# EAGLE schematic brick_i2c_gyro_l3gd20 (EAGLE 7.3.0)
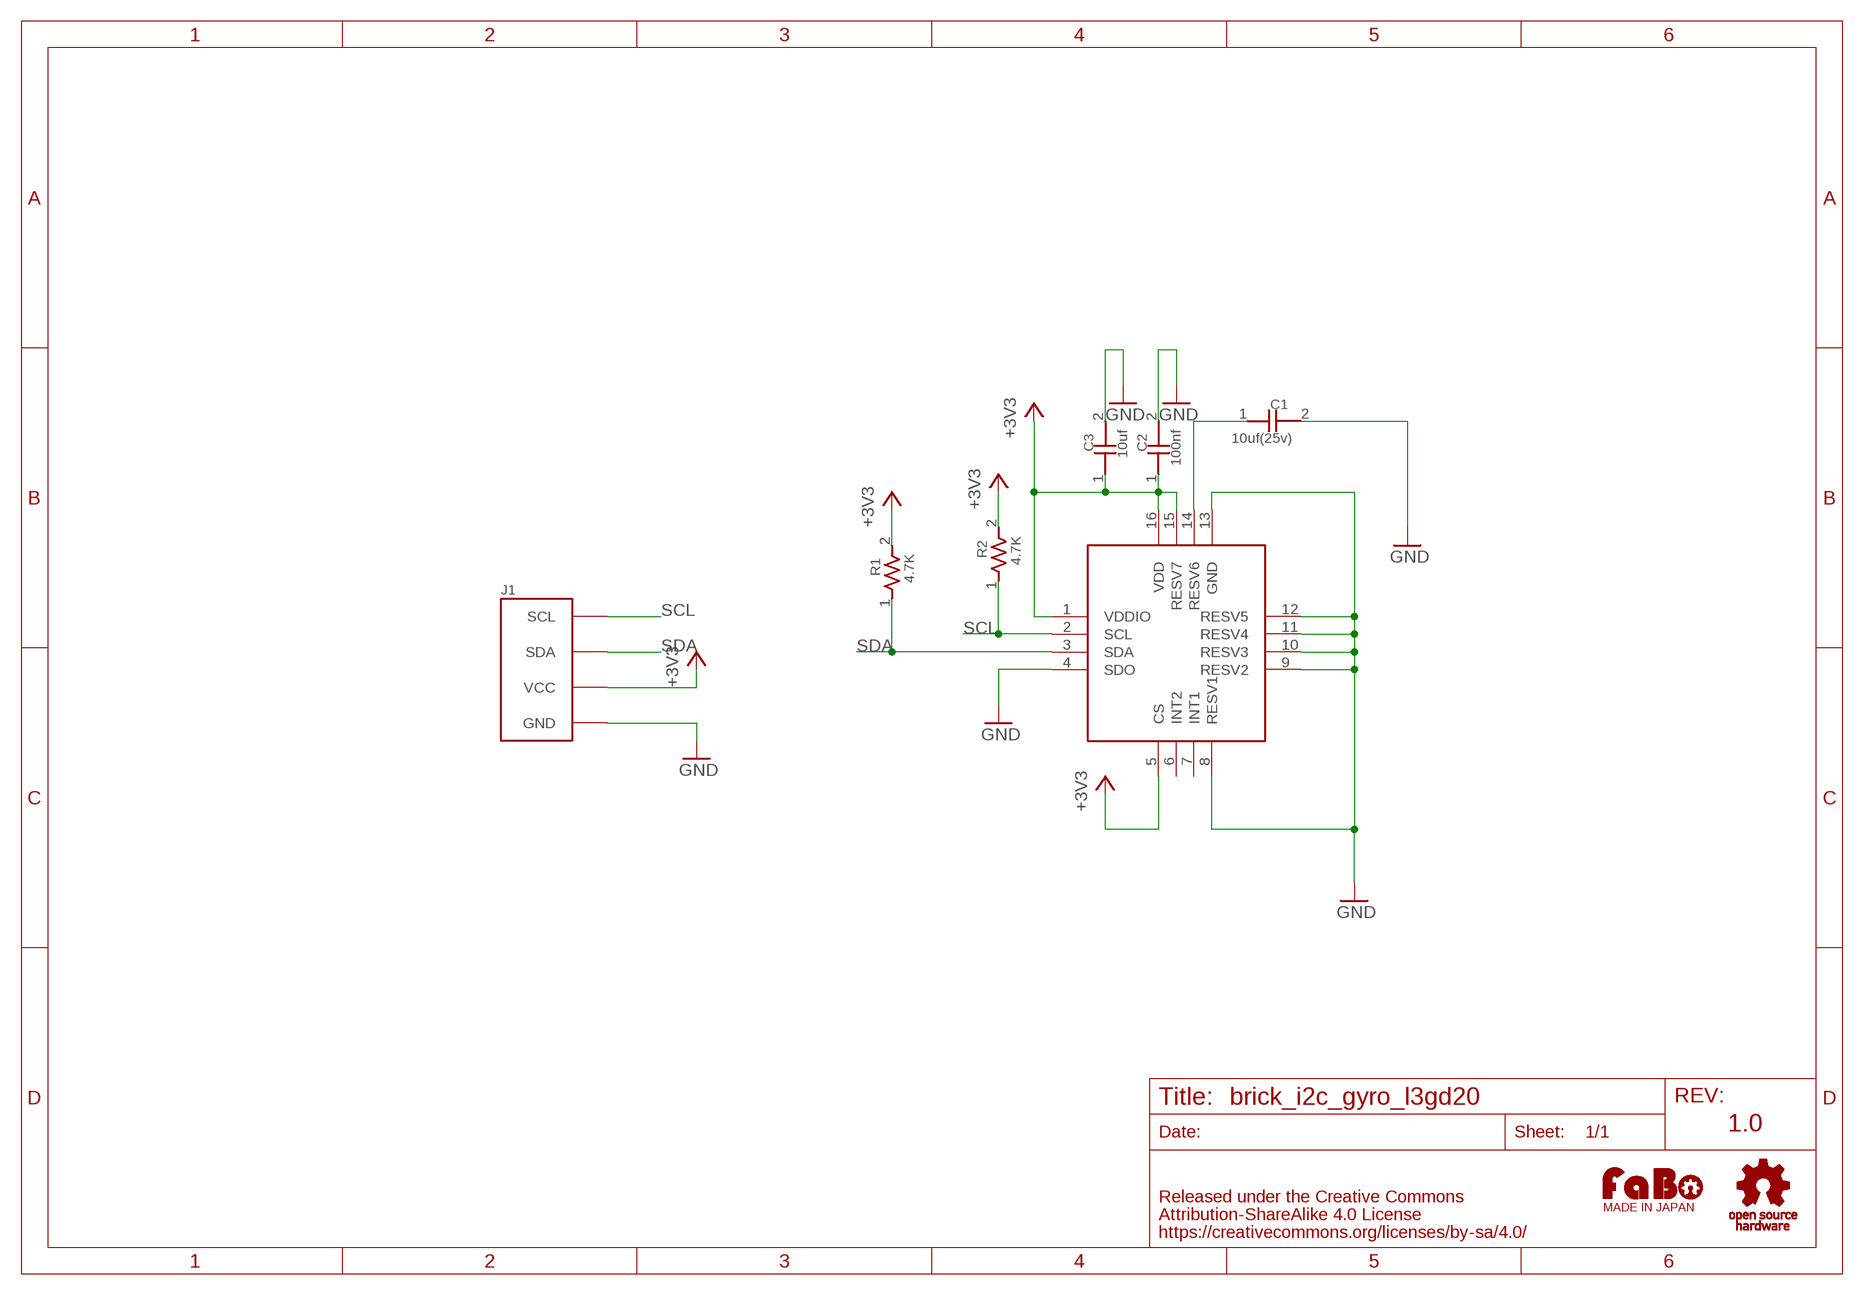
[diagram p0: schematic, sheet 1]

## Parts
C1  10uf(25v)  CAPACITOR0603  [0603]
C2  100nf  CAPACITOR0603  [0603]
C3  10uf  CAPACITOR0603  [0603]
J1  BRICK_I2C  [BRICK_I2C]
R1  4.7K  RESISTOR0603  [0603]
R2  4.7K  RESISTOR0603  [0603]
U$1  LOGO_OSHW_T-M  [LOGO_OSHW_T_M]
U$3  ST-L3GD20  [LGA-16]
U$4  LOGO_FABO-M  [LOGO_FABO_M]

## Nets
+3V3: C2.1 C3.1 J1.VCC R1.2 R2.2 U$3.1(VDDIO) U$3.5(CS) U$3.15(RESV7) U$3.16(VDD)
GND: C1.2 C2.2 C3.2 J1.GND U$3.4(SDO) U$3.8(RESV1) U$3.9(RESV2) U$3.10(RESV3) U$3.11(RESV4) U$3.12(RESV5) U$3.13(GND)
N$3: C1.1 U$3.14(RESV6)
SCL: J1.SCL R2.1 U$3.2(SCL)
SDA: J1.SDA R1.1 U$3.3(SDA)
Unconnected: U$3.6(INT2) U$3.7(INT1)

## Notes on the sheet
- 1.0

## Library data of the parts
C1-C3 = GClue-Capacitor:CAPACITOR
J1 = gclue:BRICK_I2C: FaBo Brick 4pin(I2C)
R1 R2 = GClue-Resistors:RESISTOR
U$1 = gclue:LOGO_OSHW_T
U$3 = GClue-Mems:ST-L3GD20
U$4 = FaBo:LOGO_FABO